# EAGLE schematic ROHM_102022 (EAGLE 9.6.2)
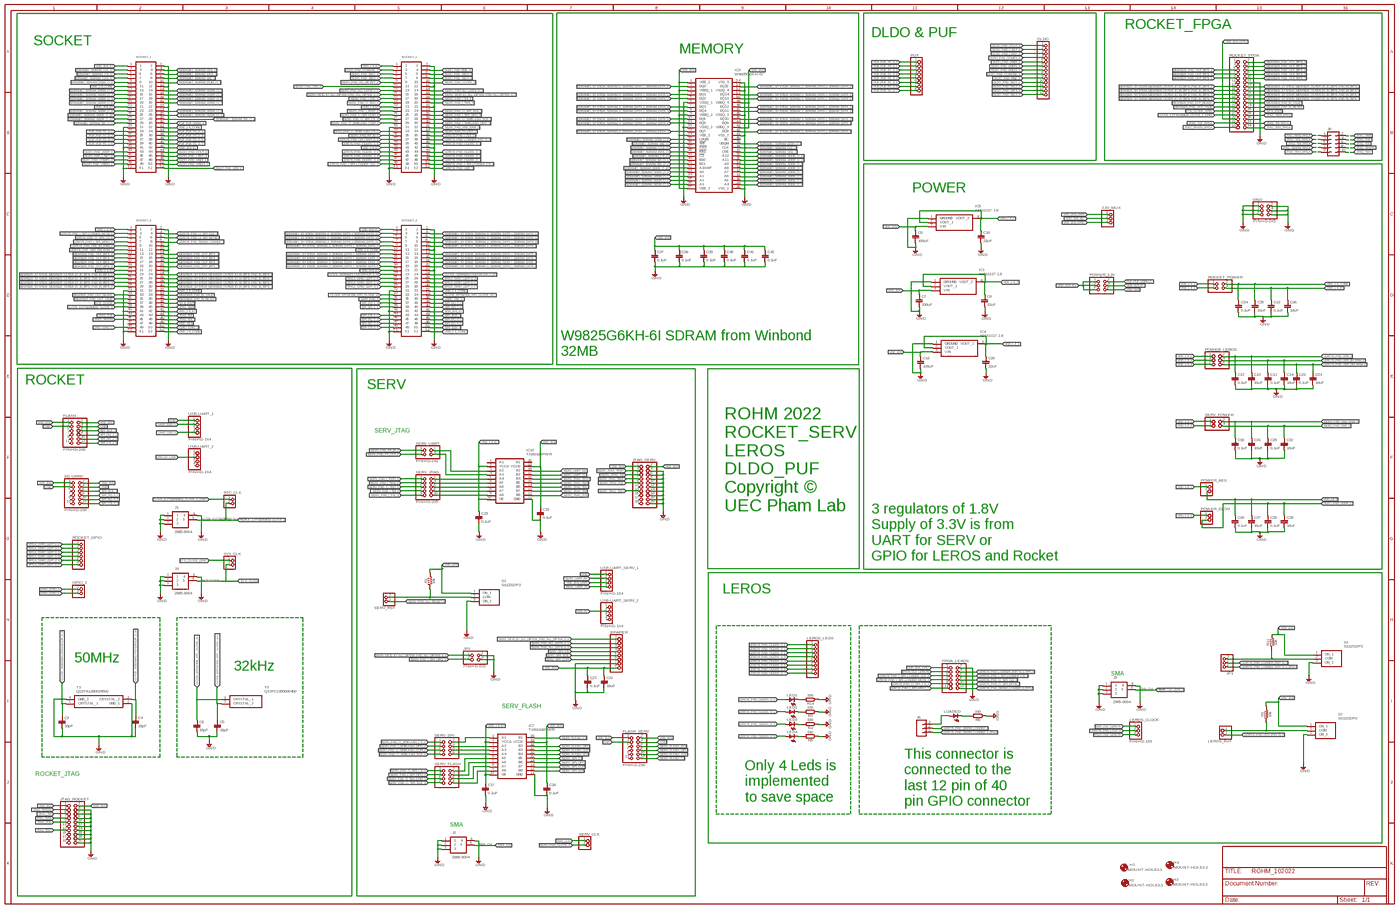
[diagram p0: schematic, sheet 1, overview]
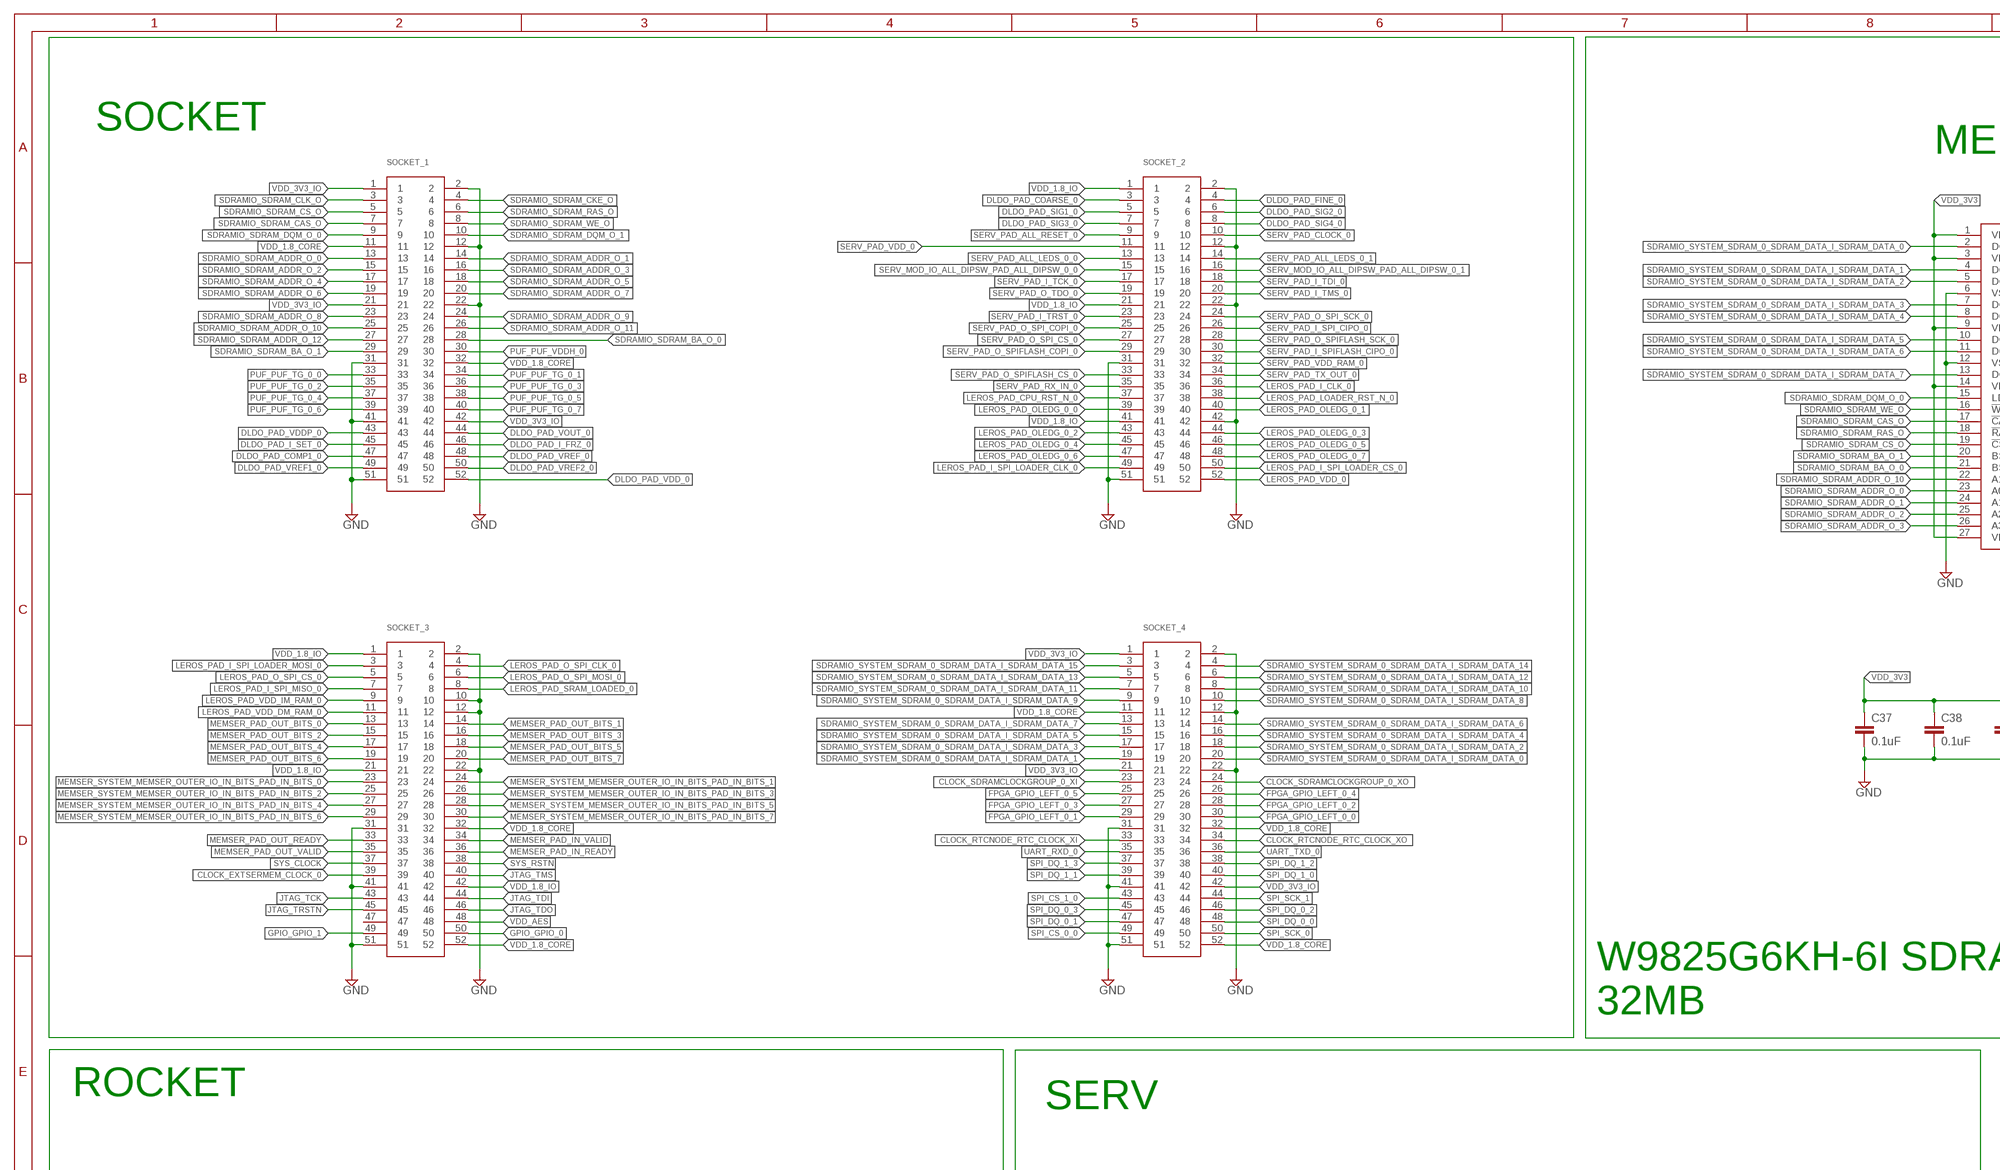
[diagram p1: schematic, sheet 1, part 1 of 4]
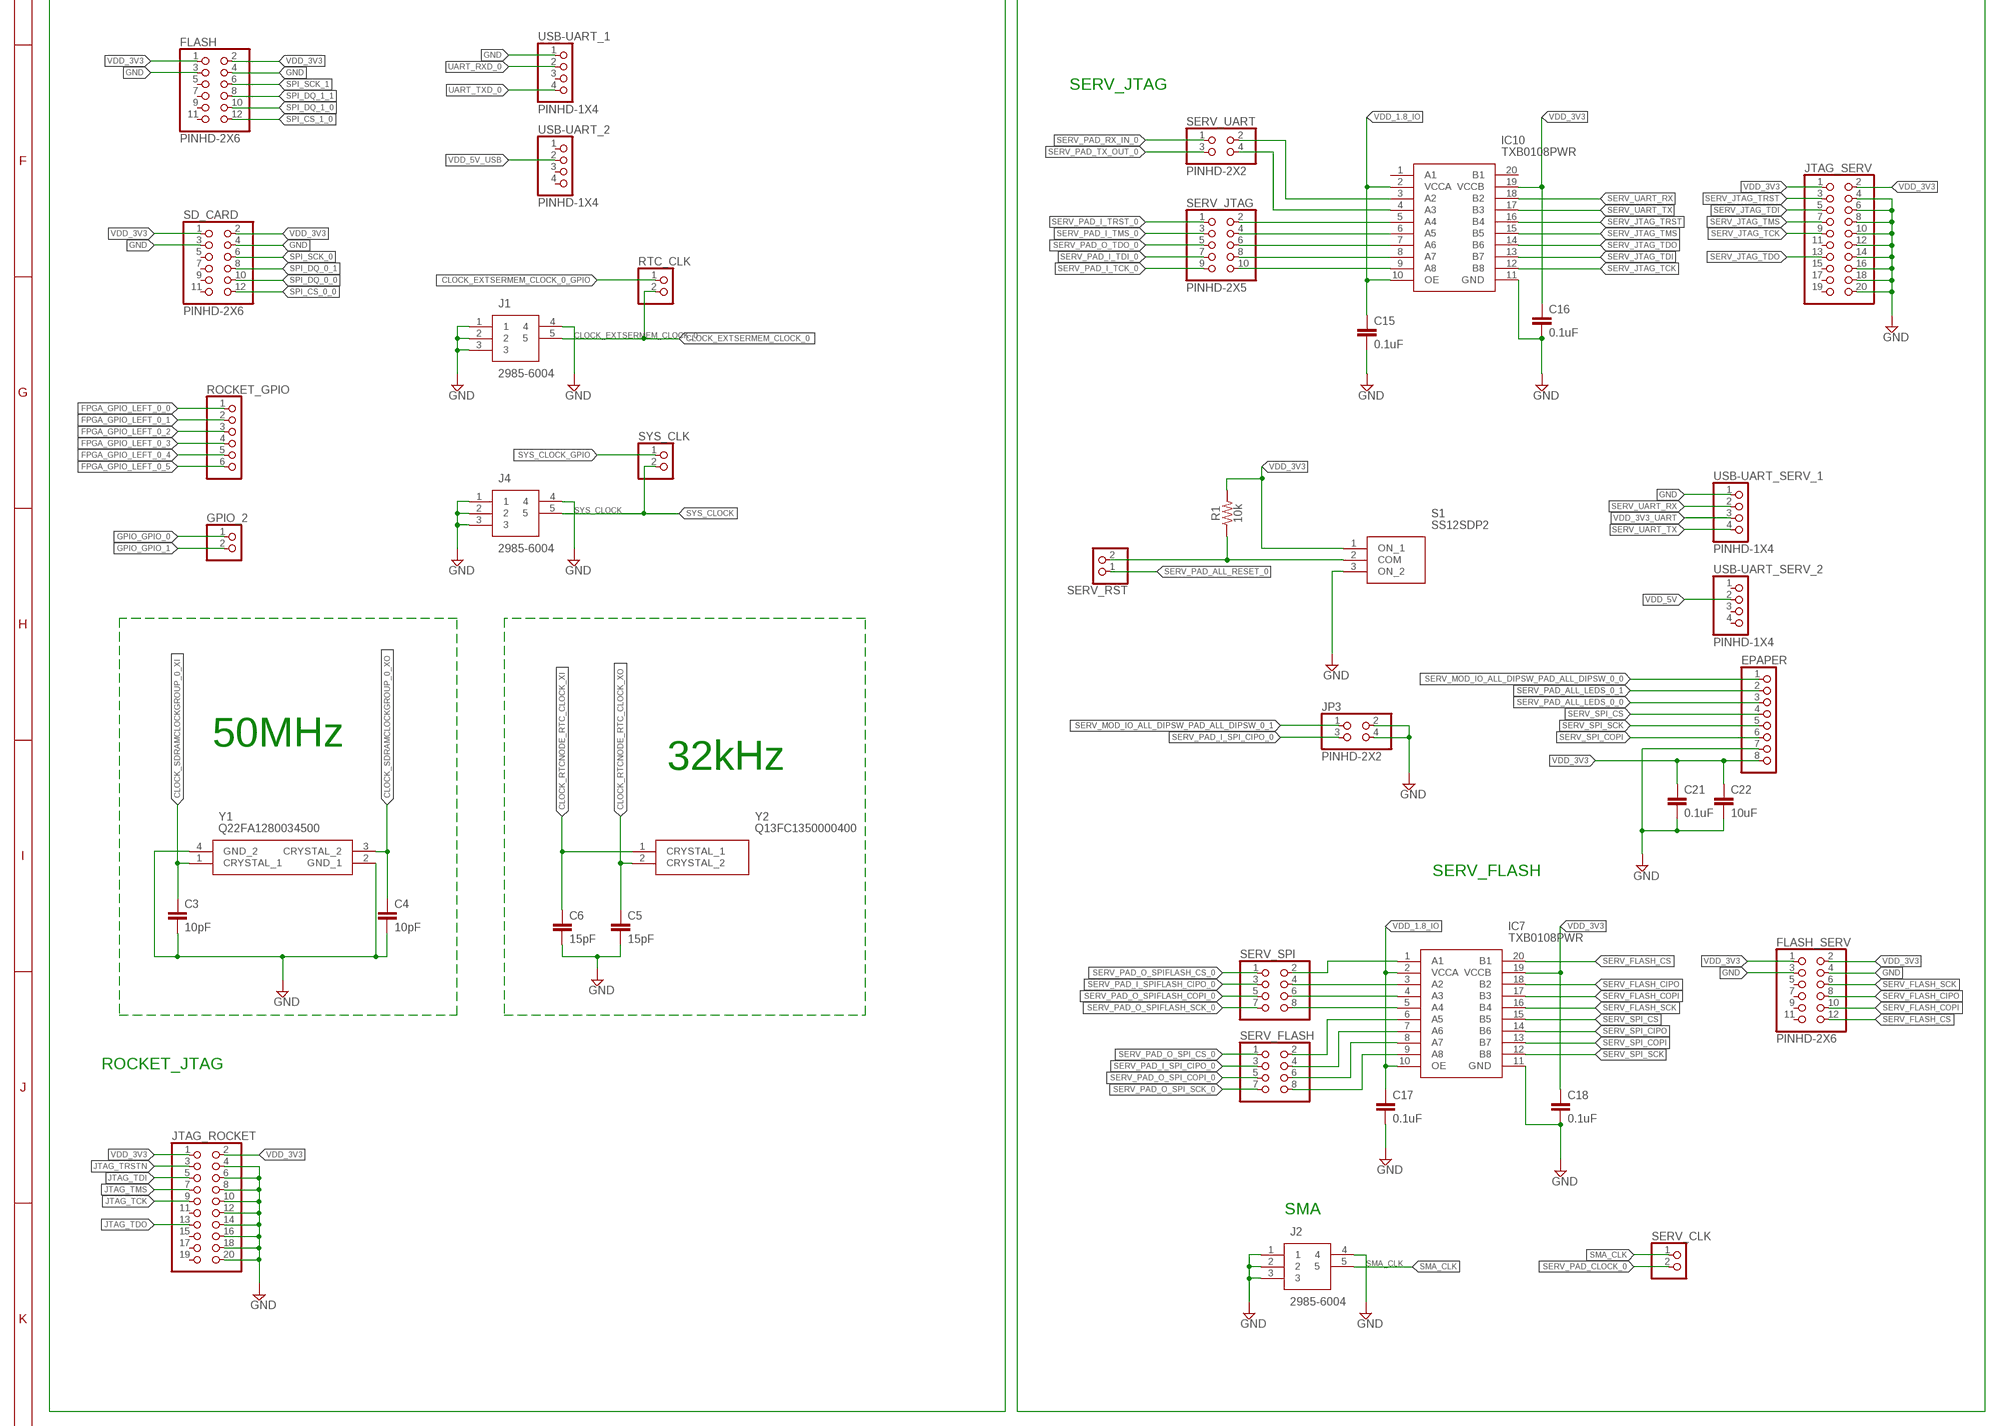
[diagram p2: schematic, sheet 1, part 2 of 4]
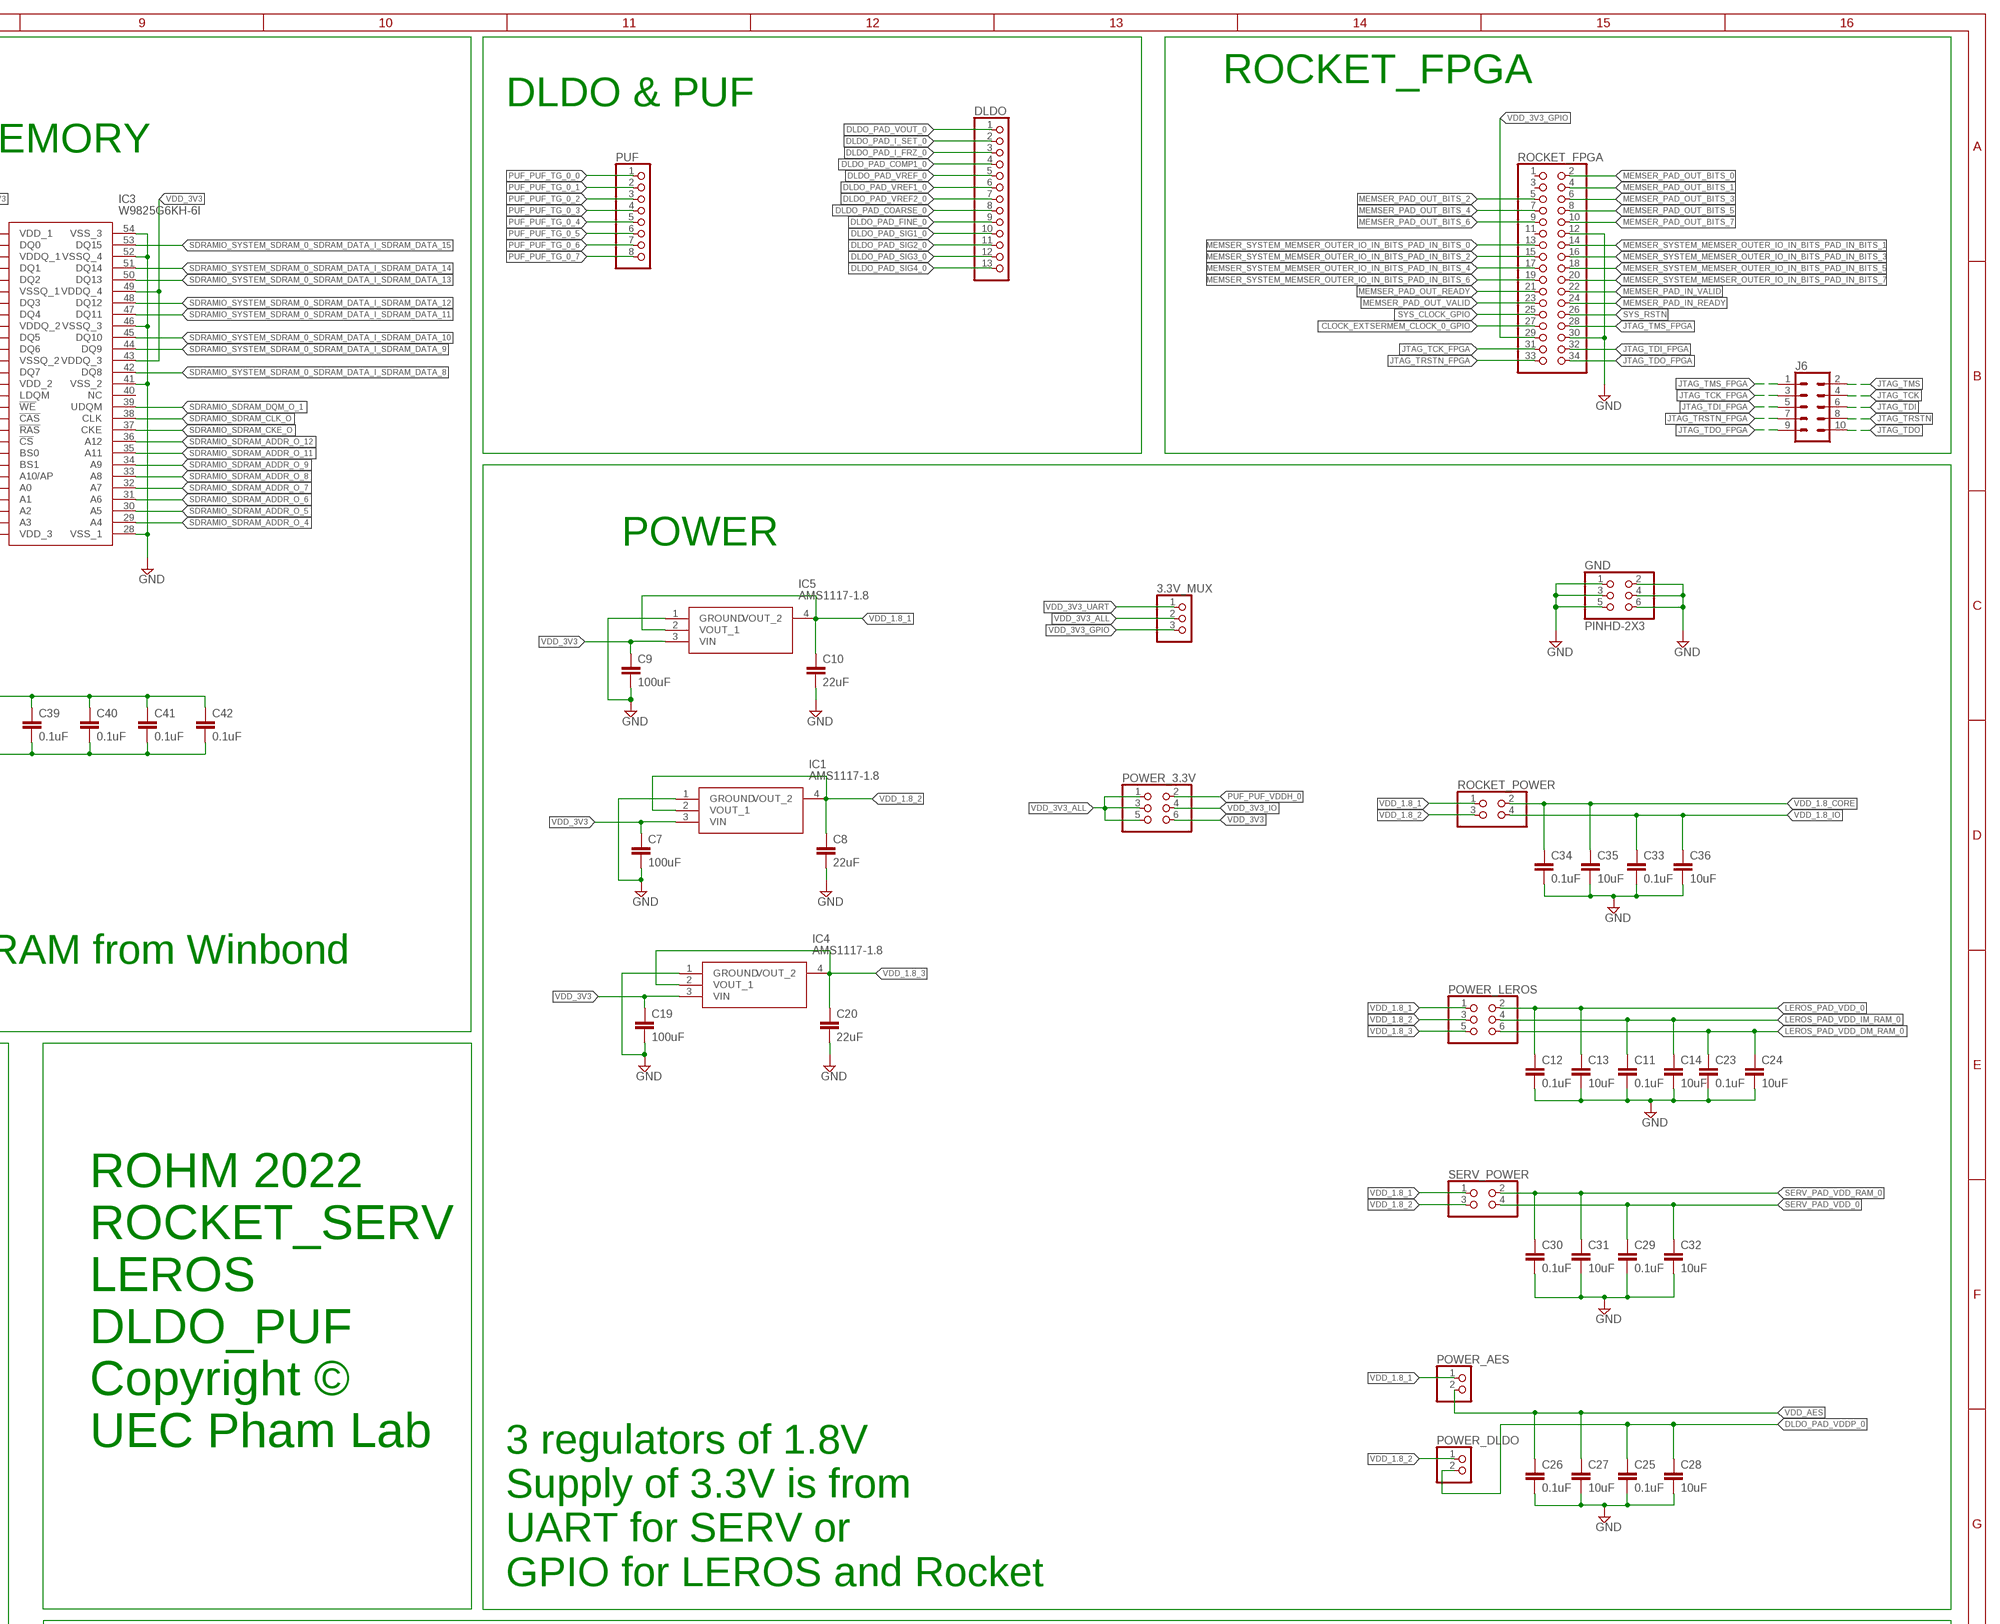
[diagram p3: schematic, sheet 1, part 3 of 4]
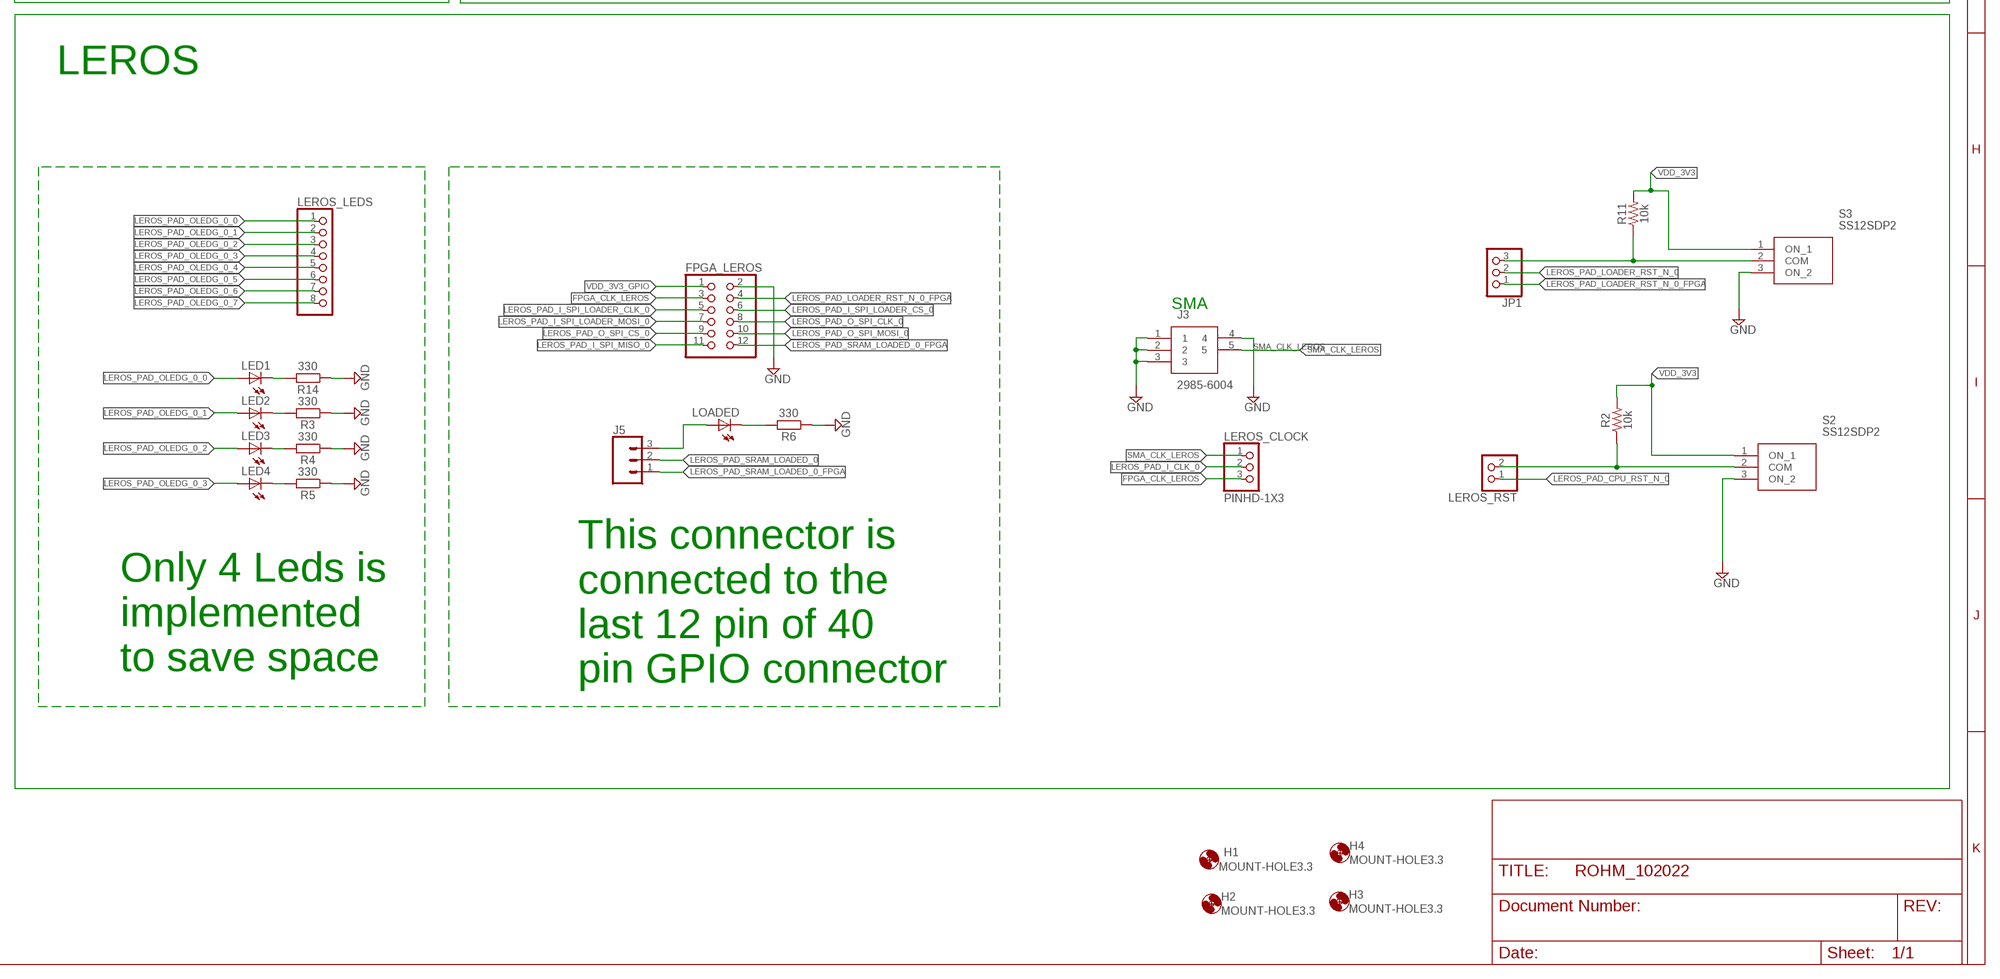
[diagram p4: schematic, sheet 1, part 4 of 4]

## Parts
3.3V_MUX  PINHD-1X3  [1X03]
C3  10pF  1.0UF-1206-50V-10%  [1206]
C4  10pF  1.0UF-1206-50V-10%  [1206]
C5  15pF  1.0UF-1206-50V-10%  [1206]
C6  15pF  1.0UF-1206-50V-10%  [1206]
C7  100uF  1.0UF-1206-50V-10%  [1206]
C8  22uF  1.0UF-1206-50V-10%  [1206]
C9  100uF  1.0UF-1206-50V-10%  [1206]
C10  22uF  1.0UF-1206-50V-10%  [1206]
C11  0.1uF  1.0UF-1206-50V-10%  [1206]
C12  0.1uF  1.0UF-1206-50V-10%  [1206]
C13  10uF  1.0UF-1206-50V-10%  [1206]
C14  10uF  1.0UF-1206-50V-10%  [1206]
C15  0.1uF  10UF-1206-6.3V-20%  [1206]
C16  0.1uF  10UF-1206-6.3V-20%  [1206]
C17  0.1uF  10UF-1206-6.3V-20%  [1206]
C18  0.1uF  10UF-1206-6.3V-20%  [1206]
C19  100uF  1.0UF-1206-50V-10%  [1206]
C20  22uF  1.0UF-1206-50V-10%  [1206]
C21  0.1uF  10UF-1206-6.3V-20%  [1206]
C22  10uF  10UF-1206-6.3V-20%  [1206]
C23  0.1uF  1.0UF-1206-50V-10%  [1206]
C24  10uF  1.0UF-1206-50V-10%  [1206]
C25  0.1uF  1.0UF-1206-50V-10%  [1206]
C26  0.1uF  1.0UF-1206-50V-10%  [1206]
C27  10uF  1.0UF-1206-50V-10%  [1206]
C28  10uF  1.0UF-1206-50V-10%  [1206]
C29  0.1uF  1.0UF-1206-50V-10%  [1206]
C30  0.1uF  1.0UF-1206-50V-10%  [1206]
C31  10uF  1.0UF-1206-50V-10%  [1206]
C32  10uF  1.0UF-1206-50V-10%  [1206]
C33  0.1uF  1.0UF-1206-50V-10%  [1206]
C34  0.1uF  1.0UF-1206-50V-10%  [1206]
C35  10uF  1.0UF-1206-50V-10%  [1206]
C36  10uF  1.0UF-1206-50V-10%  [1206]
C37  0.1uF  10UF-1206-6.3V-20%  [1206]
C38  0.1uF  10UF-1206-6.3V-20%  [1206]
C39  0.1uF  10UF-1206-6.3V-20%  [1206]
C40  0.1uF  10UF-1206-6.3V-20%  [1206]
C41  0.1uF  10UF-1206-6.3V-20%  [1206]
C42  0.1uF  10UF-1206-6.3V-20%  [1206]
DLDO  PINHD-1X13  [1X13]
EPAPER  PINHD-1X8  [1X08]
FLASH  PINHD-2X6  [2X06]
FLASH_SERV  PINHD-2X6  [2X06]
FPGA_LEROS  PINHD-2X6  [2X06]
GND  PINHD-2X3  [2X03]
GPIO_2  PINHD-1X2  [1X02]
H1  MOUNT-HOLE3.3  [3,3]
H2  MOUNT-HOLE3.3  [3,3]
H3  MOUNT-HOLE3.3  [3,3]
H4  MOUNT-HOLE3.3  [3,3]
IC1  AMS1117-1.8  AMS1117  [SOT229P700X180-4N]
IC3  W9825G6KH-6I  [SOP80P1176X120-54N]
IC4  AMS1117-1.8  AMS1117  [SOT229P700X180-4N]
IC5  AMS1117-1.8  AMS1117  [SOT229P700X180-4N]
IC7  TXB0108PWR  [SOP65P640X120-20N]
IC10  TXB0108PWR  [SOP65P640X120-20N]
J1  2985-6004  [29856004]
J2  2985-6004  [29856004]
J3  2985-6004  [29856004]
J4  2985-6004  [29856004]
J5  CONN_03  [1X03]
J6  CONN_05X2PTH  [2X5]
JP1  PINHD-1X3  [1X03]
JP3  PINHD-2X2  [2X02]
JTAG_ROCKET  PINHD-2X10  [2X10]
JTAG_SERV  PINHD-2X10  [2X10]
LED1  LEDCHIPLED_0805  [CHIPLED_0805]
LED2  LEDCHIPLED_0805  [CHIPLED_0805]
LED3  LEDCHIPLED_0805  [CHIPLED_0805]
LED4  LEDCHIPLED_0805  [CHIPLED_0805]
LEROS_CLOCK  PINHD-1X3  [1X03]
LEROS_LEDS  PINHD-1X8  [1X08]
LEROS_RST  PINHD-1X2  [1X02]
LOADED  LEDCHIPLED_0805  [CHIPLED_0805]
POWER_3.3V  PINHD-2X3  [2X03]
POWER_AES  PINHD-1X2  [1X02]
POWER_DLDO  PINHD-1X2  [1X02]
POWER_LEROS  PINHD-2X3  [2X03]
PUF  PINHD-1X8  [1X08]
R1  10k  10OHM-1206-1/4W-1%  [1206]
R2  10k  10OHM-1206-1/4W-1%  [1206]
R3  330  R_CHIP-1206(3216-METRIC)  [RESC3216X70]
R4  330  R_CHIP-1206(3216-METRIC)  [RESC3216X70]
R5  330  R_CHIP-1206(3216-METRIC)  [RESC3216X70]
R6  330  R_CHIP-1206(3216-METRIC)  [RESC3216X70]
R11  10k  10OHM-1206-1/4W-1%  [1206]
R14  330  R_CHIP-1206(3216-METRIC)  [RESC3216X70]
ROCKET_FPGA  PINHD-2X17  [2X17]
ROCKET_GPIO  PINHD-1X6  [1X06]
ROCKET_POWER  PINHD-2X2  [2X02]
RTC_CLK  PINHD-1X2  [1X02]
S1  SS12SDP2  [SS12SDP2]
S2  SS12SDP2  [SS12SDP2]
S3  SS12SDP2  [SS12SDP2]
SD_CARD  PINHD-2X6  [2X06]
SERV_CLK  PINHD-1X2  [1X02]
SERV_FLASH  PINHD-2X4  [2X04]
SERV_JTAG  PINHD-2X5  [2X05]
SERV_POWER  PINHD-2X2  [2X02]
SERV_RST  PINHD-1X2  [1X02]
SERV_SPI  PINHD-2X4  [2X04]
SERV_UART  PINHD-2X2  [2X02]
SOCKET_1  2X26_HEADER  [2X26_HEADER]
SOCKET_2  2X26_HEADER  [2X26_HEADER]
SOCKET_3  2X26_HEADER  [2X26_HEADER]
SOCKET_4  2X26_HEADER  [2X26_HEADER]
SYS_CLK  PINHD-1X2  [1X02]
USB-UART_1  PINHD-1X4  [1X04]
USB-UART_2  PINHD-1X4  [1X04]
USB-UART_SERV_1  PINHD-1X4  [1X04]
USB-UART_SERV_2  PINHD-1X4  [1X04]
Y1  Q22FA1280034500  [Q22FA1280034500]
Y2  Q13FC1350000400  [Q13FC1350000400]

## Nets
CLOCK_EXTSERMEM_CLOCK_0: J1.5 RTC_CLK.2 SOCKET_3.39
CLOCK_EXTSERMEM_CLOCK_0_GPIO: ROCKET_FPGA.27 RTC_CLK.1
CLOCK_RTCNODE_RTC_CLOCK_XI: C6.1 SOCKET_4.33 Y2.1(CRYSTAL_1)
CLOCK_RTCNODE_RTC_CLOCK_XO: C5.1 SOCKET_4.34 Y2.2(CRYSTAL_2)
CLOCK_SDRAMCLOCKGROUP_0_XI: C3.1 SOCKET_4.23 Y1.1(CRYSTAL_1)
CLOCK_SDRAMCLOCKGROUP_0_XO: C4.1 SOCKET_4.24 Y1.3(CRYSTAL_2)
DLDO_PAD_COARSE_0: DLDO.8 SOCKET_2.3
DLDO_PAD_COMP1_0: DLDO.4 SOCKET_1.47
DLDO_PAD_FINE_0: DLDO.9 SOCKET_2.4
DLDO_PAD_I_FRZ_0: DLDO.3 SOCKET_1.46
DLDO_PAD_I_SET_0: DLDO.2 SOCKET_1.45
DLDO_PAD_SIG1_0: DLDO.10 SOCKET_2.5
DLDO_PAD_SIG2_0: DLDO.11 SOCKET_2.6
DLDO_PAD_SIG3_0: DLDO.12 SOCKET_2.7
DLDO_PAD_SIG4_0: DLDO.13 SOCKET_2.8
DLDO_PAD_VDD_0: SOCKET_1.52
DLDO_PAD_VDDP_0: C25.1 C28.1 POWER_DLDO.2 SOCKET_1.43
DLDO_PAD_VOUT_0: DLDO.1 SOCKET_1.44
DLDO_PAD_VREF1_0: DLDO.6 SOCKET_1.49
DLDO_PAD_VREF2_0: DLDO.7 SOCKET_1.50
DLDO_PAD_VREF_0: DLDO.5 SOCKET_1.48
FPGA_CLK_LEROS: FPGA_LEROS.3 LEROS_CLOCK.3
FPGA_GPIO_LEFT_0_0: ROCKET_GPIO.1 SOCKET_4.30
FPGA_GPIO_LEFT_0_1: ROCKET_GPIO.2 SOCKET_4.29
FPGA_GPIO_LEFT_0_2: ROCKET_GPIO.3 SOCKET_4.28
FPGA_GPIO_LEFT_0_3: ROCKET_GPIO.4 SOCKET_4.27
FPGA_GPIO_LEFT_0_4: ROCKET_GPIO.5 SOCKET_4.26
FPGA_GPIO_LEFT_0_5: ROCKET_GPIO.6 SOCKET_4.25
GND: C3.2 C4.2 C5.2 C6.2 C7.2 C8.2 C9.2 C10.2 C11.2 C12.2 C13.2 C14.2 C15.2 C16.2 C17.2 C18.2 C19.2 C20.2 C21.2 C22.2 C23.2 C24.2 C25.2 C26.2 C27.2 C28.2 C29.2 C30.2 C31.2 C32.2 C33.2 C34.2 C35.2 C36.2 C37.2 C38.2 C39.2 C40.2 C41.2 C42.2 EPAPER.7 FLASH.3 FLASH.4 FLASH_SERV.3 FLASH_SERV.4 FPGA_LEROS.2 GND.1 GND.2 GND.3 GND.4 GND.5 GND.6 IC1.1(GROUND) IC3.6(VSSQ_1) IC3.12(VSSQ_2) IC3.28(VSS_1) IC3.41(VSS_2) IC3.46(VSSQ_3) IC3.52(VSSQ_4) IC3.54(VSS_3) IC4.1(GROUND) IC5.1(GROUND) IC7.11(GND) IC10.11(GND) J1.1 J1.2 J1.3 J1.4 J2.1 J2.2 J2.3 J2.4 J3.1 J3.2 J3.3 J3.4 J4.1 J4.2 J4.3 J4.4 JP3.2 JP3.4 JTAG_ROCKET.4 JTAG_ROCKET.6 JTAG_ROCKET.8 JTAG_ROCKET.10 JTAG_ROCKET.12 JTAG_ROCKET.14 JTAG_ROCKET.16 JTAG_ROCKET.18 JTAG_ROCKET.20 JTAG_SERV.4 JTAG_SERV.6 JTAG_SERV.8 JTAG_SERV.10 JTAG_SERV.12 JTAG_SERV.14 JTAG_SERV.16 JTAG_SERV.18 JTAG_SERV.20 R3.1 R4.1 R5.1 R6.1 R14.1 ROCKET_FPGA.12 ROCKET_FPGA.30 S1.3(ON_2) S2.3(ON_2) S3.3(ON_2) SD_CARD.3 SD_CARD.4 SOCKET_1.2 SOCKET_1.12 SOCKET_1.22 SOCKET_1.31 SOCKET_1.41 SOCKET_1.51 SOCKET_2.2 SOCKET_2.12 SOCKET_2.22 SOCKET_2.31 SOCKET_2.42 SOCKET_2.51 SOCKET_3.2 SOCKET_3.10 SOCKET_3.12 SOCKET_3.22 SOCKET_3.31 SOCKET_3.41 SOCKET_3.51 SOCKET_4.2 SOCKET_4.12 SOCKET_4.22 SOCKET_4.31 SOCKET_4.41 SOCKET_4.51 USB-UART_1.1 USB-UART_SERV_1.1 Y1.2(GND_1) Y1.4(GND_2)
GPIO_GPIO_0: GPIO_2.1 SOCKET_3.50
GPIO_GPIO_1: GPIO_2.2 SOCKET_3.49
JTAG_TCK: J6.4 JTAG_ROCKET.9 SOCKET_3.43
JTAG_TCK_FPGA: J6.3 ROCKET_FPGA.31
JTAG_TDI: J6.6 JTAG_ROCKET.5 SOCKET_3.44
JTAG_TDI_FPGA: J6.5 ROCKET_FPGA.32
JTAG_TDO: J6.10 JTAG_ROCKET.13 SOCKET_3.46
JTAG_TDO_FPGA: J6.9 ROCKET_FPGA.34
JTAG_TMS: J6.2 JTAG_ROCKET.7 SOCKET_3.40
JTAG_TMS_FPGA: J6.1 ROCKET_FPGA.28
JTAG_TRSTN: J6.8 JTAG_ROCKET.3 SOCKET_3.45
JTAG_TRSTN_FPGA: J6.7 ROCKET_FPGA.33
LEROS_PAD_CPU_RST_N_0: LEROS_RST.1 SOCKET_2.37
LEROS_PAD_I_CLK_0: LEROS_CLOCK.2 SOCKET_2.36
LEROS_PAD_I_SPI_LOADER_CLK_0: FPGA_LEROS.5 SOCKET_2.49
LEROS_PAD_I_SPI_LOADER_CS_0: FPGA_LEROS.6 SOCKET_2.50
LEROS_PAD_I_SPI_LOADER_MOSI_0: FPGA_LEROS.7 SOCKET_3.3
LEROS_PAD_I_SPI_MISO_0: FPGA_LEROS.11 SOCKET_3.7
LEROS_PAD_LOADER_RST_N_0: JP1.2 SOCKET_2.38
LEROS_PAD_LOADER_RST_N_0_FPGA: FPGA_LEROS.4 JP1.1
LEROS_PAD_O_SPI_CLK_0: FPGA_LEROS.8 SOCKET_3.4
LEROS_PAD_O_SPI_CS_0: FPGA_LEROS.9 SOCKET_3.5
LEROS_PAD_O_SPI_MOSI_0: FPGA_LEROS.10 SOCKET_3.6
LEROS_PAD_OLEDG_0_0: LED1.A LEROS_LEDS.1 SOCKET_2.39
LEROS_PAD_OLEDG_0_1: LED2.A LEROS_LEDS.2 SOCKET_2.40
LEROS_PAD_OLEDG_0_2: LED3.A LEROS_LEDS.3 SOCKET_2.43
LEROS_PAD_OLEDG_0_3: LED4.A LEROS_LEDS.4 SOCKET_2.44
LEROS_PAD_OLEDG_0_4: LEROS_LEDS.5 SOCKET_2.45
LEROS_PAD_OLEDG_0_5: LEROS_LEDS.6 SOCKET_2.46
LEROS_PAD_OLEDG_0_6: LEROS_LEDS.7 SOCKET_2.47
LEROS_PAD_OLEDG_0_7: LEROS_LEDS.8 SOCKET_2.48
LEROS_PAD_SRAM_LOADED_0: J5.2 SOCKET_3.8
LEROS_PAD_SRAM_LOADED_0_FPGA: FPGA_LEROS.12 J5.1
LEROS_PAD_VDD_0: C12.1 C13.1 POWER_LEROS.2 SOCKET_2.52
LEROS_PAD_VDD_DM_RAM_0: C23.1 C24.1 POWER_LEROS.6 SOCKET_3.11
LEROS_PAD_VDD_IM_RAM_0: C11.1 C14.1 POWER_LEROS.4 SOCKET_3.9
MEMSER_PAD_IN_READY: ROCKET_FPGA.24 SOCKET_3.36
MEMSER_PAD_IN_VALID: ROCKET_FPGA.22 SOCKET_3.34
MEMSER_PAD_OUT_BITS_0: ROCKET_FPGA.2 SOCKET_3.13
MEMSER_PAD_OUT_BITS_1: ROCKET_FPGA.4 SOCKET_3.14
MEMSER_PAD_OUT_BITS_2: ROCKET_FPGA.5 SOCKET_3.15
MEMSER_PAD_OUT_BITS_3: ROCKET_FPGA.6 SOCKET_3.16
MEMSER_PAD_OUT_BITS_4: ROCKET_FPGA.7 SOCKET_3.17
MEMSER_PAD_OUT_BITS_5: ROCKET_FPGA.8 SOCKET_3.18
MEMSER_PAD_OUT_BITS_6: ROCKET_FPGA.9 SOCKET_3.19
MEMSER_PAD_OUT_BITS_7: ROCKET_FPGA.10 SOCKET_3.20
MEMSER_PAD_OUT_READY: ROCKET_FPGA.21 SOCKET_3.33
MEMSER_PAD_OUT_VALID: ROCKET_FPGA.23 SOCKET_3.35
MEMSER_SYSTEM_MEMSER_OUTER_IO_IN_BITS_PAD_IN_BITS_0: ROCKET_FPGA.13 SOCKET_3.23
MEMSER_SYSTEM_MEMSER_OUTER_IO_IN_BITS_PAD_IN_BITS_1: ROCKET_FPGA.14 SOCKET_3.24
MEMSER_SYSTEM_MEMSER_OUTER_IO_IN_BITS_PAD_IN_BITS_2: ROCKET_FPGA.15 SOCKET_3.25
MEMSER_SYSTEM_MEMSER_OUTER_IO_IN_BITS_PAD_IN_BITS_3: ROCKET_FPGA.16 SOCKET_3.26
MEMSER_SYSTEM_MEMSER_OUTER_IO_IN_BITS_PAD_IN_BITS_4: ROCKET_FPGA.17 SOCKET_3.27
MEMSER_SYSTEM_MEMSER_OUTER_IO_IN_BITS_PAD_IN_BITS_5: ROCKET_FPGA.18 SOCKET_3.28
MEMSER_SYSTEM_MEMSER_OUTER_IO_IN_BITS_PAD_IN_BITS_6: ROCKET_FPGA.19 SOCKET_3.29
MEMSER_SYSTEM_MEMSER_OUTER_IO_IN_BITS_PAD_IN_BITS_7: ROCKET_FPGA.20 SOCKET_3.30
N$1: IC7.1(A1) SERV_SPI.2
N$2: LED1.C R14.2
N$3: IC7.3(A2) SERV_SPI.4
N$4: IC7.4(A3) SERV_SPI.6
N$5: IC7.5(A4) SERV_SPI.8
N$6: JP1.3 R11.1 S3.2(COM)
N$7: LED2.C R3.2
N$8: LED3.C R4.2
N$9: LED4.C R5.2
N$10: IC7.6(A5) SERV_FLASH.2
N$11: IC7.7(A6) SERV_FLASH.4
N$12: IC7.8(A7) SERV_FLASH.6
N$13: IC7.9(A8) SERV_FLASH.8
N$14: LOADED.C R6.2
N$15: J5.3 LOADED.A
N$23: IC10.9(A8) SERV_JTAG.10
N$24: IC10.8(A7) SERV_JTAG.8
N$25: IC10.7(A6) SERV_JTAG.6
N$26: IC10.6(A5) SERV_JTAG.4
N$27: IC10.5(A4) SERV_JTAG.2
N$28: IC10.4(A3) SERV_UART.4
N$29: IC10.3(A2) SERV_UART.2
PUF_PUF_TG_0_0: PUF.1 SOCKET_1.33
PUF_PUF_TG_0_1: PUF.2 SOCKET_1.34
PUF_PUF_TG_0_2: PUF.3 SOCKET_1.35
PUF_PUF_TG_0_3: PUF.4 SOCKET_1.36
PUF_PUF_TG_0_4: PUF.5 SOCKET_1.37
PUF_PUF_TG_0_5: PUF.6 SOCKET_1.38
PUF_PUF_TG_0_6: PUF.7 SOCKET_1.39
PUF_PUF_TG_0_7: PUF.8 SOCKET_1.40
PUF_PUF_VDDH_0: POWER_3.3V.2 SOCKET_1.30
RST_SW: R1.1 S1.2(COM) SERV_RST.2
RST_SW1: LEROS_RST.2 R2.1 S2.2(COM)
SDRAMIO_SDRAM_ADDR_O_0: IC3.23(A0) SOCKET_1.13
SDRAMIO_SDRAM_ADDR_O_1: IC3.24(A1) SOCKET_1.14
SDRAMIO_SDRAM_ADDR_O_2: IC3.25(A2) SOCKET_1.15
SDRAMIO_SDRAM_ADDR_O_3: IC3.26(A3) SOCKET_1.16
SDRAMIO_SDRAM_ADDR_O_4: IC3.29(A4) SOCKET_1.17
SDRAMIO_SDRAM_ADDR_O_5: IC3.30(A5) SOCKET_1.18
SDRAMIO_SDRAM_ADDR_O_6: IC3.31(A6) SOCKET_1.19
SDRAMIO_SDRAM_ADDR_O_7: IC3.32(A7) SOCKET_1.20
SDRAMIO_SDRAM_ADDR_O_8: IC3.33(A8) SOCKET_1.23
SDRAMIO_SDRAM_ADDR_O_9: IC3.34(A9) SOCKET_1.24
SDRAMIO_SDRAM_ADDR_O_10: IC3.22(A10/AP) SOCKET_1.25
SDRAMIO_SDRAM_ADDR_O_11: IC3.35(A11) SOCKET_1.26
SDRAMIO_SDRAM_ADDR_O_12: IC3.36(A12) SOCKET_1.27
SDRAMIO_SDRAM_BA_O_0: IC3.21(BS1) SOCKET_1.28
SDRAMIO_SDRAM_BA_O_1: IC3.20(BS0) SOCKET_1.29
SDRAMIO_SDRAM_CAS_O: IC3.17(!CAS) SOCKET_1.7
SDRAMIO_SDRAM_CKE_O: IC3.37(CKE) SOCKET_1.4
SDRAMIO_SDRAM_CLK_O: IC3.38(CLK) SOCKET_1.3
SDRAMIO_SDRAM_CS_O: IC3.19(!CS) SOCKET_1.5
SDRAMIO_SDRAM_DQM_O_0: IC3.15(LDQM) SOCKET_1.9
SDRAMIO_SDRAM_DQM_O_1: IC3.39(UDQM) SOCKET_1.10
SDRAMIO_SDRAM_RAS_O: IC3.18(!RAS) SOCKET_1.6
SDRAMIO_SDRAM_WE_O: IC3.16(!WE) SOCKET_1.8
SDRAMIO_SYSTEM_SDRAM_0_SDRAM_DATA_I_SDRAM_DATA_0: IC3.2(DQ0) SOCKET_4.20
SDRAMIO_SYSTEM_SDRAM_0_SDRAM_DATA_I_SDRAM_DATA_1: IC3.4(DQ1) SOCKET_4.19
SDRAMIO_SYSTEM_SDRAM_0_SDRAM_DATA_I_SDRAM_DATA_2: IC3.5(DQ2) SOCKET_4.18
SDRAMIO_SYSTEM_SDRAM_0_SDRAM_DATA_I_SDRAM_DATA_3: IC3.7(DQ3) SOCKET_4.17
SDRAMIO_SYSTEM_SDRAM_0_SDRAM_DATA_I_SDRAM_DATA_4: IC3.8(DQ4) SOCKET_4.16
SDRAMIO_SYSTEM_SDRAM_0_SDRAM_DATA_I_SDRAM_DATA_5: IC3.10(DQ5) SOCKET_4.15
SDRAMIO_SYSTEM_SDRAM_0_SDRAM_DATA_I_SDRAM_DATA_6: IC3.11(DQ6) SOCKET_4.14
SDRAMIO_SYSTEM_SDRAM_0_SDRAM_DATA_I_SDRAM_DATA_7: IC3.13(DQ7) SOCKET_4.13
SDRAMIO_SYSTEM_SDRAM_0_SDRAM_DATA_I_SDRAM_DATA_8: IC3.42(DQ8) SOCKET_4.10
SDRAMIO_SYSTEM_SDRAM_0_SDRAM_DATA_I_SDRAM_DATA_9: IC3.44(DQ9) SOCKET_4.9
SDRAMIO_SYSTEM_SDRAM_0_SDRAM_DATA_I_SDRAM_DATA_10: IC3.45(DQ10) SOCKET_4.8
SDRAMIO_SYSTEM_SDRAM_0_SDRAM_DATA_I_SDRAM_DATA_11: IC3.47(DQ11) SOCKET_4.7
SDRAMIO_SYSTEM_SDRAM_0_SDRAM_DATA_I_SDRAM_DATA_12: IC3.48(DQ12) SOCKET_4.6
SDRAMIO_SYSTEM_SDRAM_0_SDRAM_DATA_I_SDRAM_DATA_13: IC3.50(DQ13) SOCKET_4.5
SDRAMIO_SYSTEM_SDRAM_0_SDRAM_DATA_I_SDRAM_DATA_14: IC3.51(DQ14) SOCKET_4.4
SDRAMIO_SYSTEM_SDRAM_0_SDRAM_DATA_I_SDRAM_DATA_15: IC3.53(DQ15) SOCKET_4.3
SERV_FLASH_CIPO: FLASH_SERV.8 IC7.18(B2)
SERV_FLASH_COPI: FLASH_SERV.10 IC7.17(B3)
SERV_FLASH_CS: FLASH_SERV.12 IC7.20(B1)
SERV_FLASH_SCK: FLASH_SERV.6 IC7.16(B4)
SERV_JTAG_TCK: IC10.12(B8) JTAG_SERV.9
SERV_JTAG_TDI: IC10.13(B7) JTAG_SERV.5
SERV_JTAG_TDO: IC10.14(B6) JTAG_SERV.13
SERV_JTAG_TMS: IC10.15(B5) JTAG_SERV.7
SERV_JTAG_TRST: IC10.16(B4) JTAG_SERV.3
SERV_MOD_IO_ALL_DIPSW_PAD_ALL_DIPSW_0_0: EPAPER.1 SOCKET_2.15
SERV_MOD_IO_ALL_DIPSW_PAD_ALL_DIPSW_0_1: JP3.1 SOCKET_2.16
SERV_PAD_ALL_LEDS_0_0: EPAPER.3 SOCKET_2.13
SERV_PAD_ALL_LEDS_0_1: EPAPER.2 SOCKET_2.14
SERV_PAD_ALL_RESET_0: SERV_RST.1 SOCKET_2.9
SERV_PAD_CLOCK_0: SERV_CLK.2 SOCKET_2.10
SERV_PAD_I_SPI_CIPO_0: JP3.3 SERV_FLASH.3 SOCKET_2.26
SERV_PAD_I_SPIFLASH_CIPO_0: SERV_SPI.3 SOCKET_2.30
SERV_PAD_I_TCK_0: SERV_JTAG.9 SOCKET_2.17
SERV_PAD_I_TDI_0: SERV_JTAG.7 SOCKET_2.18
SERV_PAD_I_TMS_0: SERV_JTAG.3 SOCKET_2.20
SERV_PAD_I_TRST_0: SERV_JTAG.1 SOCKET_2.23
SERV_PAD_O_SPI_COPI_0: SERV_FLASH.5 SOCKET_2.25
SERV_PAD_O_SPI_CS_0: SERV_FLASH.1 SOCKET_2.27
SERV_PAD_O_SPI_SCK_0: SERV_FLASH.7 SOCKET_2.24
SERV_PAD_O_SPIFLASH_COPI_0: SERV_SPI.5 SOCKET_2.29
SERV_PAD_O_SPIFLASH_CS_0: SERV_SPI.1 SOCKET_2.33
SERV_PAD_O_SPIFLASH_SCK_0: SERV_SPI.7 SOCKET_2.28
SERV_PAD_O_TDO_0: SERV_JTAG.5 SOCKET_2.19
SERV_PAD_RX_IN_0: SERV_UART.1 SOCKET_2.35
SERV_PAD_TX_OUT_0: SERV_UART.3 SOCKET_2.34
SERV_PAD_VDD_0: C29.1 C32.1 SERV_POWER.4 SOCKET_2.11
SERV_PAD_VDD_RAM_0: C30.1 C31.1 SERV_POWER.2 SOCKET_2.32
SERV_SPI_CIPO: IC7.14(B6)
SERV_SPI_COPI: EPAPER.6 IC7.13(B7)
SERV_SPI_CS: EPAPER.4 IC7.15(B5)
SERV_SPI_SCK: EPAPER.5 IC7.12(B8)
SERV_UART_RX: IC10.18(B2) USB-UART_SERV_1.2
SERV_UART_TX: IC10.17(B3) USB-UART_SERV_1.4
SMA_CLK: J2.5 SERV_CLK.1
SMA_CLK_LEROS: J3.5 LEROS_CLOCK.1
SPI_CS_0_0: SD_CARD.12 SOCKET_4.49
SPI_CS_1_0: FLASH.12 SOCKET_4.43
SPI_DQ_0_0: SD_CARD.10 SOCKET_4.48
SPI_DQ_0_1: SD_CARD.8 SOCKET_4.47
SPI_DQ_0_2: SOCKET_4.46
SPI_DQ_0_3: SOCKET_4.45
SPI_DQ_1_0: FLASH.10 SOCKET_4.40
SPI_DQ_1_1: FLASH.8 SOCKET_4.39
SPI_DQ_1_2: SOCKET_4.38
SPI_DQ_1_3: SOCKET_4.37
SPI_SCK_0: SD_CARD.6 SOCKET_4.50
SPI_SCK_1: FLASH.6 SOCKET_4.44
SYS_CLOCK: J4.5 SOCKET_3.37 SYS_CLK.2
SYS_CLOCK_GPIO: ROCKET_FPGA.25 SYS_CLK.1
SYS_RSTN: ROCKET_FPGA.26 SOCKET_3.38
UART_RXD_0: SOCKET_4.35 USB-UART_1.2
UART_TXD_0: SOCKET_4.36 USB-UART_1.4
VDD_1.8_1: C10.1 IC5.2(VOUT_1) IC5.4(VOUT_2) POWER_AES.1 POWER_LEROS.1 ROCKET_POWER.1 SERV_POWER.1
VDD_1.8_2: C8.1 IC1.2(VOUT_1) IC1.4(VOUT_2) POWER_DLDO.1 POWER_LEROS.3 ROCKET_POWER.3 SERV_POWER.3
VDD_1.8_3: C20.1 IC4.2(VOUT_1) IC4.4(VOUT_2) POWER_LEROS.5
VDD_1.8_CORE: C34.1 C35.1 ROCKET_POWER.2 SOCKET_1.11 SOCKET_1.32 SOCKET_3.32 SOCKET_3.52 SOCKET_4.11 SOCKET_4.32 SOCKET_4.52
VDD_1.8_IO: C15.1 C17.1 C33.1 C36.1 IC7.2(VCCA) IC7.10(OE) IC10.2(VCCA) IC10.10(OE) ROCKET_POWER.4 SOCKET_2.1 SOCKET_2.21 SOCKET_2.41 SOCKET_3.1 SOCKET_3.21 SOCKET_3.42
VDD_3V3: C7.1 C9.1 C16.1 C18.1 C19.1 C21.1 C22.1 C37.1 C38.1 C39.1 C40.1 C41.1 C42.1 EPAPER.8 FLASH.1 FLASH.2 FLASH_SERV.1 FLASH_SERV.2 IC1.3(VIN) IC3.1(VDD_1) IC3.3(VDDQ_1) IC3.9(VDDQ_2) IC3.14(VDD_2) IC3.27(VDD_3) IC3.43(VDDQ_3) IC3.49(VDDQ_4) IC4.3(VIN) IC5.3(VIN) IC7.19(VCCB) IC10.19(VCCB) JTAG_ROCKET.1 JTAG_ROCKET.2 JTAG_SERV.1 JTAG_SERV.2 POWER_3.3V.6 R1.2 R2.2 R11.2 S1.1(ON_1) S2.1(ON_1) S3.1(ON_1) SD_CARD.1 SD_CARD.2
VDD_3V3_ALL: 3.3V_MUX.2 POWER_3.3V.1 POWER_3.3V.3 POWER_3.3V.5
VDD_3V3_GPIO: 3.3V_MUX.3 FPGA_LEROS.1 ROCKET_FPGA.29
VDD_3V3_IO: POWER_3.3V.4 SOCKET_1.1 SOCKET_1.21 SOCKET_1.42 SOCKET_4.1 SOCKET_4.21 SOCKET_4.42
VDD_3V3_UART: 3.3V_MUX.1 USB-UART_SERV_1.3
VDD_5V: USB-UART_SERV_2.2
VDD_5V_USB: USB-UART_2.2
VDD_AES: C26.1 C27.1 POWER_AES.2 SOCKET_3.48
Unconnected: FLASH.5 FLASH.7 FLASH.9 FLASH.11 FLASH_SERV.5 FLASH_SERV.7 FLASH_SERV.9 FLASH_SERV.11 IC3.40(NC) IC10.1(A1) IC10.20(B1) JTAG_ROCKET.11 JTAG_ROCKET.15 JTAG_ROCKET.17 JTAG_ROCKET.19 JTAG_SERV.11 JTAG_SERV.15 JTAG_SERV.17 JTAG_SERV.19 ROCKET_FPGA.1 ROCKET_FPGA.3 ROCKET_FPGA.11 SD_CARD.5 SD_CARD.7 SD_CARD.9 SD_CARD.11 SOCKET_3.47 USB-UART_1.3 USB-UART_2.1 USB-UART_2.3 USB-UART_2.4 USB-UART_SERV_2.1 USB-UART_SERV_2.3 USB-UART_SERV_2.4

## Notes on the sheet
- ROCKET_FPGA
- DLDO & PUF
- SOCKET
- MEMORY
- POWER
- W9825G6KH-6I SDRAM from Winbond
  32MB
- ROCKET
- SERV
- SERV_JTAG
- ROHM 2022 
  ROCKET_SERV
  LEROS
  DLDO_PUF
  Copyright © 
  UEC Pham Lab
- 3 regulators of 1.8V
  Supply of 3.3V is from
  UART for SERV or
  GPIO for LEROS and Rocket
- LEROS
- 50MHz
- 32kHz
- SMA
- SERV_FLASH
- ROCKET_JTAG
- Only 4 Leds is 
  implemented
  to save space
- This connector is
  connected to the 
  last 12 pin of 40 
  pin GPIO connector
- SMA

## Library data of the parts
3.3V_MUX JP1 = pinhead:PINHD-1X3: PIN HEADER
C3-C14 C19 C20 C23-C36 = SparkFun-Capacitors:1.0UF: 1µF ceramic capacitors A capacitor is a passive two-terminal electrical component used to store electrical energy temporarily in an electric field.; PROD_ID: CAP-09822; VALUE: 1.0uF
C15-C18 C21 C37-C42 = SparkFun-Capacitors:10UF: 10.0µF ceramic capacitors A capacitor is a passive two-terminal electrical component used to store electrical energy temporarily in an electric field.; PROD_ID: CAP-10057; VALUE: 10uF
C22 = SparkFun-Capacitors:10UF: 10.0µF ceramic capacitors A capacitor is a passive two-terminal electrical component used to store electrical energy temporarily in an electric field.; PROD_ID: CAP-10057
DLDO = pinhead:PINHD-1X13: PIN HEADER
EPAPER LEROS_LEDS PUF = pinhead:PINHD-1X8: PIN HEADER
FLASH FLASH_SERV SD_CARD = Connector:PINHD-2X6: PIN HEADER; CATEGORY: CONNECTOR; SUB-CATEGORY: PIN-HEADER
FPGA_LEROS = pinhead:PINHD-2X6: PIN HEADER
GND = Connector:PINHD-2X3: PIN HEADER; CATEGORY: CONNECTOR; SUB-CATEGORY: PIN-HEADER
GPIO_2 LEROS_RST POWER_AES POWER_DLDO RTC_CLK SERV_CLK SERV_RST SYS_CLK = pinhead:PINHD-1X2: PIN HEADER
H1-H4 = holes:MOUNT-HOLE: MOUNTING HOLE with drill center marker
IC1 IC4 IC5 = SamacSys_Parts:AMS1117: 1117 Source: Datasheet <https://datasheet.lcsc.com/szlcsc/Advanced-Monolithic-Systems-AMS-AMS1117-ADJ_C6188.pdf>; DESCRIPTION: 1117; HEIGHT: 1.8mm; MANUFACTURER_NAME: Advanced Monolithic Systems; MANUFACTURER_PART_NUMBER: AMS1117
IC3 = SamacSys_Parts:W9825G6KH-6I: The W9825G6KH is a 256M SDRAM and speed involving -5/-5I/-6/-6I/-6J/-6L/-6A/-6K/-75/75J/75L Source: Datasheet <https://www.winbond.com/hq/search-resource-file.jsp?partNo=W9825G6KH-6I&type=datasheet>; ARROW_PART_NUMBER: W9825G6KH-6I; ARROW_PRICE-STOCK: https://www.arrow.com/en/products/w9825g6kh-6i/winbond-electronics?region=nac; DESCRIPTION: The W9825G6KH is a 256M SDRAM and speed involving -5/-5I/-6/-6I/-6J/-6L/-6A/-6K/-75/75J/75L; HEIGHT: 1.2mm; MANUFACTURER_NAME: Winbond; MANUFACTURER_PART_NUMBER: W9825G6KH-6I; MOUSER_PART_NUMBER: 454-W9825G6KH-6I; MOUSER_PRICE-STOCK: https://www.mouser.co.uk/ProductDetail/Winbond/W9825G6KH-6I?qs=qSfuJ%252Bfl%2Fd43NMGOxAI88A%3D%3D
IC7 IC10 = SamacSys_Parts:TXB0108PWR: 8-Bit Bidirectional Voltage-Level Shifter with Auto Direction Sensing and +/-15-kV ESD Protect Source: Datasheet <http://www.ti.com/lit/ds/symlink/txb0108.pdf>; ARROW_PART_NUMBER: TXB0108PWR; ARROW_PRICE-STOCK: https://www.arrow.com/en/products/txb0108pwr/texas-instruments?region=nac; DESCRIPTION: 8-Bit Bidirectional Voltage-Level Shifter with Auto Direction Sensing and +/-15-kV ESD Protect; HEIGHT: 1.2mm; MANUFACTURER_NAME: Texas Instruments; MANUFACTURER_PART_NUMBER: TXB0108PWR; MOUSER_PART_NUMBER: 595-TXB0108PWR; MOUSER_PRICE-STOCK: https://www.mouser.co.uk/ProductDetail/Texas-Instruments/TXB0108PWR?qs=oFXvjAmG9EgEUWGWzOVFCA%3D%3D
J1-J4 = SamacSys_Parts:2985-6004: RF Connectors / Coaxial Connectors SMA F PCB Thru-Hole Conn, 50-OHMS 1000 Source: Datasheet <https://componentsearchengine.com//2985-6004.pdf>; DESCRIPTION: RF Connectors / Coaxial Connectors SMA F PCB Thru-Hole Conn, 50-OHMS 1000; HEIGHT: 9.54mm; MANUFACTURER_NAME: Amphenol; MANUFACTURER_PART_NUMBER: 2985-6004; MOUSER_PART_NUMBER: 523-2985-6004; MOUSER_PRICE-STOCK: https://www.mouser.co.uk/ProductDetail/Amphenol-SV-Microwave/2985-6004?qs=jyo2EwfRkUNkt8LGijRXFQ%3D%3D
J5 = SparkFun-Connectors:CONN_03: Multi connection point. Often used as Generic Header-pin footprint for 0.1 inch spaced/style header connections On any of the 0.1 inch spaced packages, you can populate with these: Break Away Headers - Straight <https://www.sparkfun.com/products/116> (PRT-00116) Break Away Male Headers - Right Angle <https://www.sparkfun.com/products/553> (PRT-00553) Female Headers <https://www.sparkfun.com/products/115> (PRT-00115) Break Away Headers - Machine Pin <https://www.sparkfun.com/products/117> (PRT-00117) Break Away Female Headers - Swiss Machine Pin <https://www.sparkfun.com/products/743> (PRT-00743) Stackable Header - 3 Pin (Female, 0.1") <https://www.sparkfun.com/products/13875> (PRT-13875) For SCREWTERMINALS and SPRING TERMINALS visit here: Screw Terimnals on SparkFun.com <https://www.sparkfun.com/search/results?term=Screw+Terminals> (5mm/3.5mm/2.54mm spacing) This device is also useful as a general connection point to wire up your design to another part of your project. Our various solder wires solder well into these plated through hole pads. Hook-Up Wire - Assortment (Stranded, 22 AWG) <https://www.sparkfun.com/products/11375> (PRT-11375) Hook-Up Wire - Assortment (Solid Core, 22 AWG) <https://www.sparkfun.com/products/11367> (PRT-11367) View the entire wire category on our website here <https://www.sparkfun.com/categories/141> Special notes: Molex polarized connector foot print use with SKU : PRT-08232 with associated crimp pins and housings.
J6 = SparkFun-Connectors:CONN_05X2: Multi connection point. Often used as Generic Header-pin footprint for 0.1 inch spaced/style header connections For AVR SPI programming port, see special device with nice symbol: "AVR_SPI_PROG_5x2.dev" You can populate with any combo of single row headers, but if you'd like an exact match, check these: 2x5 AVR ICSP Male Header <https://www.sparkfun.com/products/778> (PRT-00778) 2x5 Pin Shrouded Header <https://www.sparkfun.com/products/8506> (PRT-08506) On any of the 0.1 inch spaced packages, you can populate with these: Break Away Headers - Straight <https://www.sparkfun.com/products/116> (PRT-00116) Break Away Male Headers - Right Angle <https://www.sparkfun.com/products/553> (PRT-00553) Female Headers <https://www.sparkfun.com/products/115> (PRT-00115) Break Away Headers - Machine Pin <https://www.sparkfun.com/products/117> (PRT-00117) Break Away Female Headers - Swiss Machine Pin <https://www.sparkfun.com/products/743> (PRT-00743) Special note: the shrouded connector mates well with our 5x2 ribbon cables: 2x5 Pin IDC Ribbon Cable <https://www.sparkfun.com/products/8535> (PRT-08535); PROD_ID: CONN-08499; SF_ID: PRT-0778
JP3 SERV_UART = Connector:PINHD-2X2: PIN HEADER; CATEGORY: CONNECTOR; SUB-CATEGORY: PIN-HEADER
JTAG_ROCKET JTAG_SERV = pinhead:PINHD-2X10: PIN HEADER
LED1-LED4 LOADED = adafruit:LED: LED OSRAM: - CHIPLED LG R971, LG N971, LY N971, LG Q971, LY Q971, LO R971, LY R971 LH N974, LH R974 LS Q976, LO Q976, LY Q976 LO Q996 - Hyper CHIPLED LW Q18S LB Q993, LB Q99A, LB R99A - SideLED LS A670, LO A670, LY A670, LG A670, LP A670 LB A673, LV A673, LT A673, LW A673 LH A674 LY A675 LS A676, LA A676, LO A676, LY A676, LW A676 LS A679, LY A679, LG A679 - Hyper Micro SIDELED® LS Y876, LA Y876, LO Y876, LY Y876 LT Y87S - SmartLED LW L88C, LW L88S LB L89C, LB L89S, LG L890 LS L89K, LO L89K, LY L89K LS L896, LA L896, LO L896, LY L896 - TOPLED LS T670, LO T670, LY T670, LG T670, LP T670 LSG T670, LSP T670, LSY T670, LOP T670, LYG T670 LG T671, LOG T671, LSG T671 LB T673, LV T673, LT T673, LW T673 LH T674 LS T676, LA T676, LO T676, LY T676, LB T676, LH T676, LSB T676, LW T676 LB T67C, LV T67C, LT T67C, LS T67K, LO T67K, LY T67K, LW E67C LS E67B, LA E67B, LO E67B, LY E67B, LB E67C, LV E67C, LT E67C LW T67C LS T679, LY T679, LG T679 LS T770, LO T770, LY T770, LG T770, LP T770 LB T773, LV T773, LT T773, LW T773 LH T774 LS E675, LA E675, LY E675, LS T675 LS T776, LA T776, LO T776, LY T776, LB T776 LHGB T686 LT T68C, LB T68C - Hyper Mini TOPLED® LB M676 - Mini TOPLED Santana® LG M470 LS M47K, LO M47K, LY M47K Source: http://www.osram.convergy.de/
LEROS_CLOCK = Connector:PINHD-1X3: PIN HEADER; CATEGORY: CONNECTOR; SUB-CATEGORY: PIN-HEADER
POWER_3.3V POWER_LEROS = pinhead:PINHD-2X3: PIN HEADER
R1 R2 R11 = SparkFun-Resistors:10OHM: 10Ω resistor A resistor is a passive two-terminal electrical component that implements electrical resistance as a circuit element. Resistors act to reduce current flow, and, at the same time, act to lower voltage levels within circuits. - Wikipedia; PROD_ID: RES-08705; VALUE: 10
R3-R6 R14 = Resistor:R: Resistor Fixed - Generic; CATEGORY: Resistor; SUB-CATEGORY: Fixed
ROCKET_FPGA = pinhead:PINHD-2X17: PIN HEADER
ROCKET_GPIO = pinhead:PINHD-1X6: PIN HEADER
ROCKET_POWER SERV_POWER = pinhead:PINHD-2X2: PIN HEADER
S1-S3 = SamacSys_Parts:SS12SDP2: Switch, Slide,Sub Miniature,Top Actuated,SPDT, On-none-On Source: Datasheet; DESCRIPTION: Switch, Slide,Sub Miniature,Top Actuated,SPDT, On-none-On; HEIGHT: 4mm; MANUFACTURER_NAME: NKK Switches; MANUFACTURER_PART_NUMBER: SS12SDP2; MOUSER_PART_NUMBER: 633-SS12SDP2; MOUSER_PRICE-STOCK: https://www.mouser.co.uk/ProductDetail/NKK-Switches/SS12SDP2?qs=Av7JdS0MGqKsG%252BWOKKtU2w%3D%3D
SERV_FLASH SERV_SPI = pinhead:PINHD-2X4: PIN HEADER
SERV_JTAG = Connector:PINHD-2X5: PIN HEADER; CATEGORY: CONNECTOR; SUB-CATEGORY: PIN-HEADER
SOCKET_1-SOCKET_4 = Duy:2X26_HEADER
USB-UART_1 USB-UART_2 USB-UART_SERV_1 USB-UART_SERV_2 = Connector:PINHD-1X4: PIN HEADER; CATEGORY: CONNECTOR; SUB-CATEGORY: PIN-HEADER
Y1 = SamacSys_Parts:Q22FA1280034500: MHz Range Crystal unit Source: Datasheet; DESCRIPTION: MHz Range Crystal unit; HEIGHT: 0.5mm; MANUFACTURER_NAME: Seiko; MANUFACTURER_PART_NUMBER: Q22FA1280034500
Y2 = SamacSys_Parts:Q13FC1350000400: SMD Crystal Resonators 32.768KHz +/-20ppm SMD-3215_2P RoHS Source: Datasheet <https://datasheet.lcsc.com/szlcsc/1901081604_Seiko-Epson-Q13FC1350000400_C32346.pdf>; DESCRIPTION: SMD Crystal Resonators 32.768KHz +/-20ppm SMD-3215_2P RoHS; HEIGHT: 0.9mm; MANUFACTURER_NAME: SEIKO EPSON; MANUFACTURER_PART_NUMBER: Q13FC1350000400